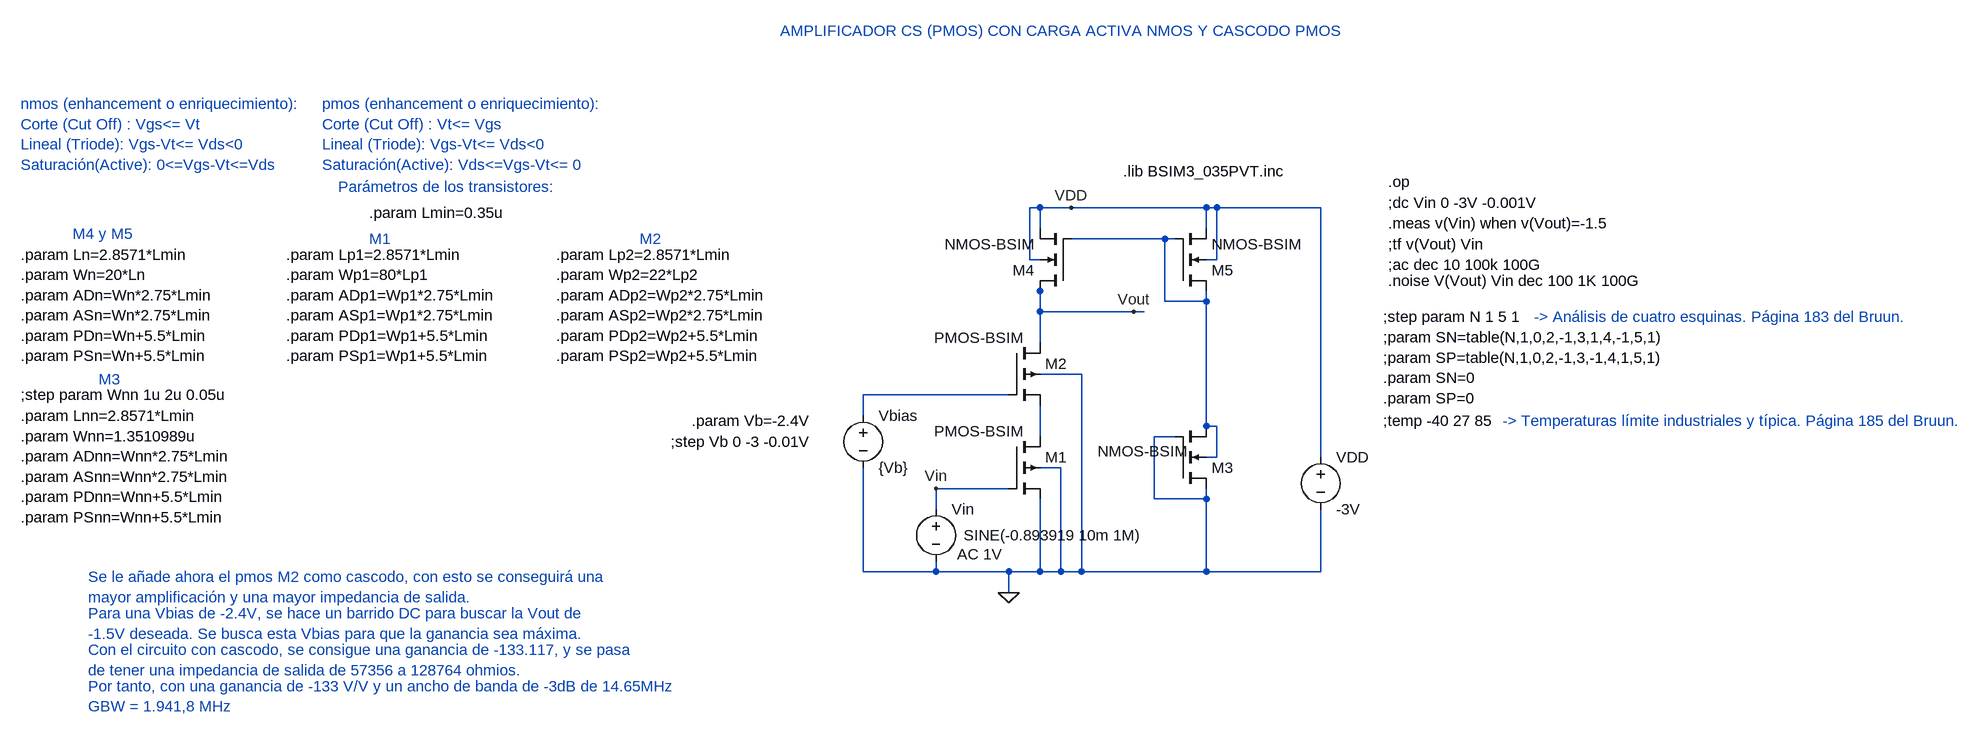
[diagram p0: schematic PMOS_CS_CMOSLOAD_CASCODE.asc]
PMOS_CS_CMOSLOAD_CASCODE.asc, the LTspice schematic file:
Version 4
SHEET 1 1864 1148
WIRE 256 336 240 336
WIRE 304 336 256 336
WIRE 512 336 304 336
WIRE 528 336 512 336
WIRE 688 336 528 336
WIRE 256 368 256 336
WIRE 512 368 512 336
WIRE 448 384 304 384
WIRE 464 384 448 384
WIRE 240 416 240 336
WIRE 256 416 240 416
WIRE 528 416 528 336
WIRE 528 416 512 416
WIRE 256 464 256 448
WIRE 448 480 448 384
WIRE 512 480 512 464
WIRE 512 480 448 480
WIRE 256 496 256 464
WIRE 400 496 256 496
WIRE 416 496 400 496
WIRE 256 544 256 496
WIRE 320 592 256 592
WIRE 208 624 -16 624
WIRE -16 656 -16 624
WIRE 512 672 512 480
WIRE 528 672 512 672
WIRE 256 688 256 640
WIRE 464 688 432 688
WIRE 528 720 528 672
WIRE 528 720 512 720
WIRE 688 720 688 336
WIRE 288 736 256 736
WIRE 208 768 96 768
WIRE 432 784 432 688
WIRE 512 784 512 768
WIRE 512 784 432 784
WIRE 96 800 96 768
WIRE -16 896 -16 736
WIRE 96 896 96 880
WIRE 96 896 -16 896
WIRE 208 896 96 896
WIRE 256 896 256 784
WIRE 256 896 208 896
WIRE 288 896 288 736
WIRE 288 896 256 896
WIRE 320 896 320 592
WIRE 320 896 288 896
WIRE 512 896 512 784
WIRE 512 896 320 896
WIRE 688 896 688 800
WIRE 688 896 512 896
WIRE 208 928 208 896
FLAG 208 928 0
FLAG 96 768 Vin
FLAG 400 496 Vout
FLAG 304 336 VDD
SYMBOL voltage 96 784 R0
WINDOW 123 33 85 Left 2
WINDOW 39 0 0 Left 2
WINDOW 3 43 56 Left 2
SYMATTR Value2 AC 1V
SYMATTR Value SINE(-0.893919 10m 1M)
SYMATTR InstName Vin
SYMBOL voltage 688 704 R0
WINDOW 123 0 0 Left 0
WINDOW 39 0 0 Left 0
SYMATTR InstName VDD
SYMATTR Value -3V
SYMBOL pmos4 208 688 R0
WINDOW 3 -115 -8 Left 2
SYMATTR Value PMOS-BSIM
SYMATTR InstName M1
SYMATTR Value2 l={Lp1} w={Wp1} ad={ADp1} as={ASp1} pd={PDp1} ps={PSp1} m=1
SYMBOL nmos4 304 464 R180
SYMATTR InstName M4
SYMATTR Value NMOS-BSIM
SYMATTR Value2 l={Ln} w={Wn} ad={ADn} as={ASn} pd={PDn} ps={PSn} m=1
SYMBOL nmos4 464 464 M180
SYMATTR InstName M5
SYMATTR Value NMOS-BSIM
SYMATTR Value2 l={Ln} w={Wn} ad={ADn} as={ASn} pd={PDn} ps={PSn} m=1
SYMBOL pmos4 208 544 R0
WINDOW 3 -115 -8 Left 2
SYMATTR Value PMOS-BSIM
SYMATTR InstName M2
SYMATTR Value2 l={Lp2} w={Wp2} ad={ADp2} as={ASp2} pd={PDp2} ps={PSp2} m=1
SYMBOL voltage -16 640 R0
WINDOW 123 0 0 Left 0
WINDOW 39 0 0 Left 0
SYMATTR InstName Vbias
SYMATTR Value {Vb}
SYMBOL nmos4 464 768 M180
WINDOW 3 -119 57 Left 2
SYMATTR Value NMOS-BSIM
SYMATTR InstName M3
SYMATTR Value2 l={Lnn} w={Wnn} ad={ADnn} as={ASnn} pd={PDnn} ps={PSnn} m=1
TEXT -144 64 Left 2 ;AMPLIFICADOR CS (PMOS) CON CARGA ACTIVA NMOS Y CASCODO PMOS
TEXT -904 408 Left 2 !.param Lp1=2.8571*Lmin\n.param Wp1=80*Lp1\n.param ADp1=Wp1*2.75*Lmin\n.param ASp1=Wp1*2.75*Lmin\n.param PDp1=Wp1+5.5*Lmin\n.param PSp1=Wp1+5.5*Lmin
TEXT -776 344 Left 2 !.param Lmin=0.35u
TEXT 792 392 Left 2 !;tf v(Vout) Vin
TEXT 792 328 Left 2 !;dc Vin 0 -3V -0.001V
TEXT 792 296 Left 2 !.op
TEXT -824 304 Left 2 ;Parámetros de los transistores:
TEXT 792 360 Left 2 !.meas v(Vin) when v(Vout)=-1.5
TEXT -848 176 Left 2 ;pmos (enhancement o enriquecimiento):\nCorte (Cut Off) : Vt<= Vgs\nLineal (Triode): Vgs-Vt<= Vds<0\nSaturación(Active): Vds<=Vgs-Vt<= 0
TEXT -1208 904 Left 2 ;Se le añade ahora el pmos M2 como cascodo, con esto se conseguirá una\nmayor amplificación y una mayor impedancia de salida.
TEXT -1312 408 Left 2 !.param Ln=2.8571*Lmin\n.param Wn=20*Ln\n.param ADn=Wn*2.75*Lmin\n.param ASn=Wn*2.75*Lmin\n.param PDn=Wn+5.5*Lmin\n.param PSn=Wn+5.5*Lmin
TEXT -1312 176 Left 2 ;nmos (enhancement o enriquecimiento):\nCorte (Cut Off) : Vgs<= Vt\nLineal (Triode): Vgs-Vt<= Vds<0\nSaturación(Active): 0<=Vgs-Vt<=Vds
TEXT 792 448 Left 2 !.noise V(Vout) Vin dec 100 1K 100G
TEXT 792 424 Left 2 !;ac dec 10 100k 100G
TEXT -1208 1016 Left 2 ;Con el circuito con cascodo, se consigue una ganancia de -133.117, y se pasa\nde tener una impedancia de salida de 57356 a 128764 ohmios.
TEXT -1208 960 Left 2 ;Para una Vbias de -2.4V, se hace un barrido DC para buscar la Vout de\n-1.5V deseada. Se busca esta Vbias para que la ganancia sea máxima.
TEXT -488 408 Left 2 !.param Lp2=2.8571*Lmin\n.param Wp2=22*Lp2\n.param ADp2=Wp2*2.75*Lmin\n.param ASp2=Wp2*2.75*Lmin\n.param PDp2=Wp2+5.5*Lmin\n.param PSp2=Wp2+5.5*Lmin
TEXT -1232 376 Left 2 ;M4 y M5
TEXT -776 384 Left 2 ;M1
TEXT -360 384 Left 2 ;M2
TEXT -1208 1072 Left 2 ;Por tanto, con una ganancia de -133 V/V y un ancho de banda de -3dB de 14.65MHz\nGBW = 1.941,8 MHz
TEXT -1312 624 Left 2 !;step param Wnn 1u 2u 0.05u
TEXT -1312 656 Left 2 !.param Lnn=2.8571*Lmin\n.param Wnn=1.3510989u\n.param ADnn=Wnn*2.75*Lmin\n.param ASnn=Wnn*2.75*Lmin\n.param PDnn=Wnn+5.5*Lmin\n.param PSnn=Wnn+5.5*Lmin
TEXT -1192 600 Left 2 ;M3
TEXT -280 664 Left 2 !.param Vb=-2.4V
TEXT -312 696 Left 2 !;step Vb 0 -3 -0.01V
TEXT 784 504 Left 2 !;step param N 1 5 1\n;param SN=table(N,1,0,2,-1,3,1,4,-1,5,1)\n;param SP=table(N,1,0,2,-1,3,-1,4,1,5,1)\n.param SN=0\n.param SP=0
TEXT 384 280 Left 2 !.lib BSIM3_035PVT.inc
TEXT 1016 504 Left 2 ;-> Análisis de cuatro esquinas. Página 183 del Bruun.
TEXT 784 664 Left 2 !;temp -40 27 85
TEXT 968 664 Left 2 ;-> Temperaturas límite industriales y típica. Página 185 del Bruun.

The netlist it stands for:
* PMOS_CS_CMOSLOAD_CASCODE.asc
Vin Vin 0 SINE(-0.893919 10m 1M) AC 1V
VDD VDD 0 -3V
M1 N003 Vin 0 0 PMOS-BSIM l={Lp1} w={Wp1} ad={ADp1} as={ASp1} pd={PDp1} ps={PSp1} m=1
M4 Vout N001 VDD VDD NMOS-BSIM l={Ln} w={Wn} ad={ADn} as={ASn} pd={PDn} ps={PSn} m=1
M5 N001 N001 VDD VDD NMOS-BSIM l={Ln} w={Wn} ad={ADn} as={ASn} pd={PDn} ps={PSn} m=1
M2 Vout N002 N003 0 PMOS-BSIM l={Lp2} w={Wp2} ad={ADp2} as={ASp2} pd={PDp2} ps={PSp2} m=1
Vbias N002 0 {Vb}
M3 0 0 N001 N001 NMOS-BSIM l={Lnn} w={Wnn} ad={ADnn} as={ASnn} pd={PDnn} ps={PSnn} m=1
.model NMOS NMOS
.model PMOS PMOS
.lib standard.mos
* AMPLIFICADOR CS (PMOS) CON CARGA ACTIVA NMOS Y CASCODO PMOS
.param Lp1=2.8571*Lmin
.param Wp1=80*Lp1
.param ADp1=Wp1*2.75*Lmin
.param ASp1=Wp1*2.75*Lmin
.param PDp1=Wp1+5.5*Lmin
.param PSp1=Wp1+5.5*Lmin
.param Lmin=0.35u
;tf v(Vout) Vin
;dc Vin 0 -3V -0.001V
.op
* Parámetros de los transistores:
.meas v(Vin) when v(Vout)=-1.5
* pmos (enhancement o enriquecimiento):
* Corte (Cut Off) : Vt<= Vgs
* Lineal (Triode): Vgs-Vt<= Vds<0
* Saturación(Active): Vds<=Vgs-Vt<= 0
* Se le añade ahora el pmos M2 como cascodo, con esto se conseguirá una
* mayor amplificación y una mayor impedancia de salida.
.param Ln=2.8571*Lmin
.param Wn=20*Ln
.param ADn=Wn*2.75*Lmin
.param ASn=Wn*2.75*Lmin
.param PDn=Wn+5.5*Lmin
.param PSn=Wn+5.5*Lmin
* nmos (enhancement o enriquecimiento):
* Corte (Cut Off) : Vgs<= Vt
* Lineal (Triode): Vgs-Vt<= Vds<0
* Saturación(Active): 0<=Vgs-Vt<=Vds
.noise V(Vout) Vin dec 100 1K 100G
;ac dec 10 100k 100G
* Con el circuito con cascodo, se consigue una ganancia de -133.117, y se pasa
* de tener una impedancia de salida de 57356 a 128764 ohmios.
* Para una Vbias de -2.4V, se hace un barrido DC para buscar la Vout de
* -1.5V deseada. Se busca esta Vbias para que la ganancia sea máxima.
.param Lp2=2.8571*Lmin
.param Wp2=22*Lp2
.param ADp2=Wp2*2.75*Lmin
.param ASp2=Wp2*2.75*Lmin
.param PDp2=Wp2+5.5*Lmin
.param PSp2=Wp2+5.5*Lmin
* M4 y M5
* M1
* M2
* Por tanto, con una ganancia de -133 V/V y un ancho de banda de -3dB de 14.65MHz
* GBW = 1.941,8 MHz
;step param Wnn 1u 2u 0.05u
.param Lnn=2.8571*Lmin
.param Wnn=1.3510989u
.param ADnn=Wnn*2.75*Lmin
.param ASnn=Wnn*2.75*Lmin
.param PDnn=Wnn+5.5*Lmin
.param PSnn=Wnn+5.5*Lmin
* M3
.param Vb=-2.4V
;step Vb 0 -3 -0.01V
;step param N 1 5 1
;param SN=table(N,1,0,2,-1,3,1,4,-1,5,1)
;param SP=table(N,1,0,2,-1,3,-1,4,1,5,1)
.param SN=0
.param SP=0
.lib BSIM3_035PVT.inc
* -> Análisis de cuatro esquinas. Página 183 del Bruun.
;temp -40 27 85
* -> Temperaturas límite industriales y típica. Página 185 del Bruun.
.backanno
.end